# EAGLE design SparkyJr_v432u4 (EAGLE 5.10)
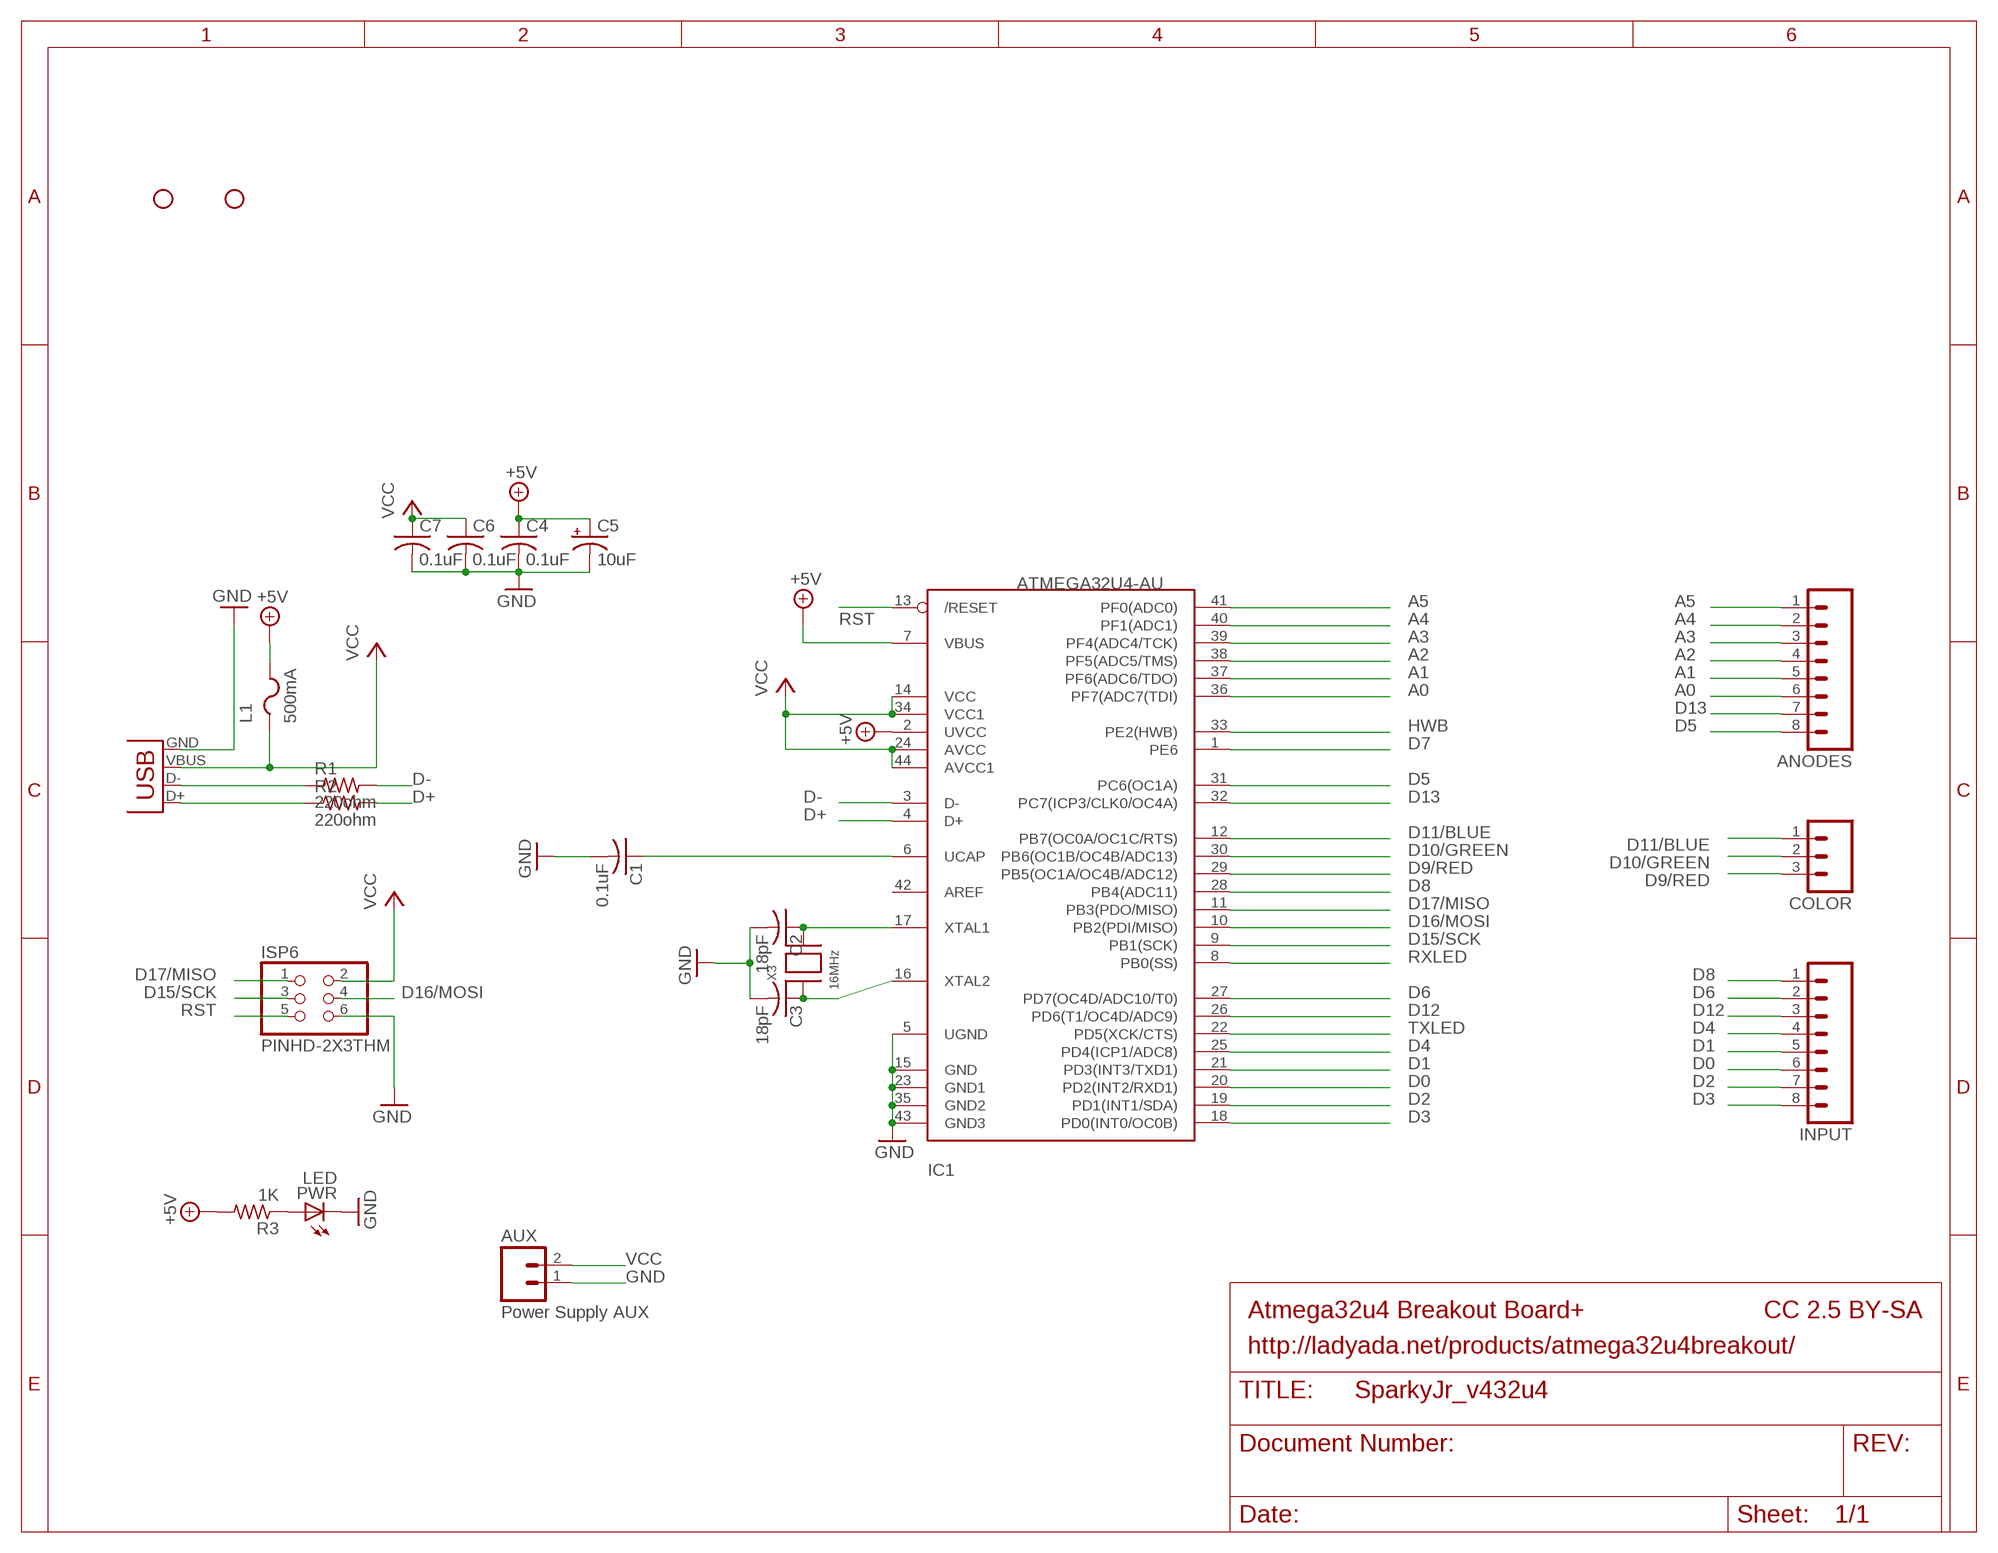
[diagram p0: schematic, sheet 1]

## Parts
ANODES  M081X08  [1X08]
AUX  Power Supply AUX  M02PTH  [1X02]
C1  0.1uF  C-USC0805K  [C0805K]
C2  18pF  C-USC0805K  [C0805K]
C3  18pF  C-USC0805K  [C0805K]
C4  0.1uF  C-USC0805K  [C0805K]
C5  10uF  CPOL-USA/3216-18R  [A/3216-18R]
C6  0.1uF  C-USC0805K  [C0805K]
C7  0.1uF  C-USC0805K  [C0805K]
CN1  MiniB USB  USBPTH  [USB-B-PTH]
COLOR  M03PTH  [1X03]
IC1  ATMEGA32U4-AU  [TQFP44]
INPUT  M081X08  [1X08]
ISP6  PINHD-2X3THM  [ISP6]
JP1  STAND-OFF  [STAND-OFF]
JP4  STAND-OFF  [STAND-OFF]
L1  500mA  PTCFUSE-1206  [R1206]
PWR  LED  LEDCHIPLED_0805  [CHIPLED_0805]
R1  220ohm  R-US_R0805  [R0805]
R2  220ohm  R-US_R0805  [R0805]
R3  1K  R-US_R0805  [R0805]
X3  16MHz  XTALNX5032  [NX5032]

## Nets
+5V: C4.1 C5.+ IC1.2(UVCC) IC1.7(VBUS) L1.2 R3.2
A0: ANODES.6 IC1.36(PF7(ADC7(TDI))
A1: ANODES.5 IC1.37(PF6(ADC6/TDO))
A2: ANODES.4 IC1.38(PF5(ADC5/TMS))
A3: ANODES.3 IC1.39(PF4(ADC4/TCK))
A4: ANODES.2 IC1.40(PF1(ADC1))
A5: ANODES.1 IC1.41(PF0(ADC0))
D0: IC1.20(PD2(INT2/RXD1)) INPUT.6
D1: IC1.21(PD3(INT3/TXD1)) INPUT.5
D2: IC1.19(PD1(INT1/SDA)) INPUT.7
D3: IC1.18(PD0(INT0/OC0B)) INPUT.8
D4: IC1.25(PD4(ICP1/ADC8)) INPUT.4
D5: ANODES.8 IC1.31(PC6(OC1A))
D6: IC1.27(PD7(OC4D/ADC10/T0)) INPUT.2
D7: IC1.1(PE6)
D8: IC1.28(PB4(ADC11)) INPUT.1
D9/RED: COLOR.3 IC1.29(PB5(OC1A/OC4B/ADC12))
D10/GREEN: COLOR.2 IC1.30(PB6(OC1B/OC4B/ADC13))
D11/BLUE: COLOR.1 IC1.12(PB7(OC0A/OC1C/RTS))
D12: IC1.26(PD6(T1/OC4D/ADC9)) INPUT.3
D13: ANODES.7 IC1.32(PC7(ICP3/CLK0/OC4A))
D15/SCK: IC1.9(PB1(SCK)) ISP6.3
D16/MOSI: IC1.10(PB2(PDI/MISO)) ISP6.4
D17/MISO: IC1.11(PB3(PDO/MISO)) ISP6.1
D+: IC1.4(D+) R2.2
D-: IC1.3(D-) R1.2
GND: AUX.1 C1.2 C2.2 C3.2 C4.2 C5.- C6.2 C7.2 CN1.GND IC1.5(UGND) IC1.15(GND) IC1.23(GND1) IC1.35(GND2) IC1.43(GND3) ISP6.6 PWR.C
HWB: IC1.33(PE2(HWB))
N$1: PWR.A R3.1
N$2: CN1.D+ R2.1
N$3: C1.1 IC1.6(UCAP)
N$5: CN1.D- R1.1
N$8: C2.1 IC1.17(XTAL1) X3.P$2
N$9: C3.1 IC1.16(XTAL2) X3.P$1
RST: IC1.13(/RESET) ISP6.5
RXLED: IC1.8(PB0(SS))
TXLED: IC1.22(PD5(XCK/CTS))
VCC: AUX.2 C6.1 C7.1 CN1.VBUS IC1.14(VCC) IC1.24(AVCC) IC1.34(VCC1) IC1.44(AVCC1) ISP6.2 L1.1
Unconnected: IC1.42(AREF)

## Notes on the sheet
- Atmega32u4 Breakout Board+ | CC 2.5 BY-SA
- http://ladyada.net/products/atmega32u4breakout/

## Library data of the parts
ANODES INPUT = SparkFun:M08: Header 8 Standard 8-pin 0.1" header. Use with straight break away headers (SKU : PRT-00116), right angle break away headers (PRT-00553), swiss pins (PRT-00743), machine pins (PRT-00117), and female headers (PRT-00115).
AUX = SparkFun:M02: Header 2 Standard 2-pin 0.1" header. Use with straight break away headers (SKU : PRT-00116), right angle break away headers (PRT-00553), swiss pins (PRT-00743), machine pins (PRT-00117), and female headers (PRT-00115). Molex polarized connector foot print use with SKU : PRT-08233 with associated crimp pins and housings.
C1-C4 C6 C7 = adafruit:C-US: CAPACITOR, American symbol
C5 = adafruit:CPOL-US: POLARIZED CAPACITOR, American symbol
CN1 = SparkFun:USB: USB Connectors USB-B-PTH is fully proven SKU : PRT-00139 USB-miniB is fully proven SKU : PRT-00587 USB-A-PCB is untested. USB-A-H is throughly reviewed, but untested. Spark Fun Electronics SKU : PRT-00437 USB-B-SMT is throughly reviewed, but untested. Needs silkscreen touching up. USB-A-S has not been used/tested USB-MB-H has not been used/tested
COLOR = SparkFun:M03: Header 3 Standard 3-pin 0.1" header. Use with straight break away headers (SKU : PRT-00116), right angle break away headers (PRT-00553), swiss pins (PRT-00743), machine pins (PRT-00117), and female headers (PRT-00115). Molex polarized connector foot print use with SKU : PRT-08232 with associated crimp pins and housings.
IC1 = adaprog:ATMEGA32U4
ISP6 = adaprog:PINHD-2X3
JP1 JP4 = SparkFun:STAND-OFF: Stand Off This is the mechanical footprint for a #4 phillips button head screw. Use the keepout ring to avoid running the screw head into surrounding components. SKU : PRT-00447
L1 = adafruit:PTCFUSE: PTC fuses, resettable thermistors
PWR = adafruit:LED: LED OSRAM: - CHIPLED LG R971, LG N971, LY N971, LG Q971, LY Q971, LO R971, LY R971 LH N974, LH R974 LS Q976, LO Q976, LY Q976 LO Q996 - Hyper CHIPLED LW Q18S LB Q993, LB Q99A, LB R99A - SideLED LS A670, LO A670, LY A670, LG A670, LP A670 LB A673, LV A673, LT A673, LW A673 LH A674 LY A675 LS A676, LA A676, LO A676, LY A676, LW A676 LS A679, LY A679, LG A679 - Hyper Micro SIDELED® LS Y876, LA Y876, LO Y876, LY Y876 LT Y87S - SmartLED LW L88C, LW L88S LB L89C, LB L89S, LG L890 LS L89K, LO L89K, LY L89K LS L896, LA L896, LO L896, LY L896 - TOPLED LS T670, LO T670, LY T670, LG T670, LP T670 LSG T670, LSP T670, LSY T670, LOP T670, LYG T670 LG T671, LOG T671, LSG T671 LB T673, LV T673, LT T673, LW T673 LH T674 LS T676, LA T676, LO T676, LY T676, LB T676, LH T676, LSB T676, LW T676 LB T67C, LV T67C, LT T67C, LS T67K, LO T67K, LY T67K, LW E67C LS E67B, LA E67B, LO E67B, LY E67B, LB E67C, LV E67C, LT E67C LW T67C LS T679, LY T679, LG T679 LS T770, LO T770, LY T770, LG T770, LP T770 LB T773, LV T773, LT T773, LW T773 LH T774 LS E675, LA E675, LY E675, LS T675 LS T776, LA T776, LO T776, LY T776, LB T776 LHGB T686 LT T68C, LB T68C - Hyper Mini TOPLED® LB M676 - Mini TOPLED Santana® LG M470 LS M47K, LO M47K, LY M47K Source: http://www.osram.convergy.de/
R1-R3 = adafruit:R-US_: RESISTOR, American symbol
X3 = adaprog:XTAL

## Board
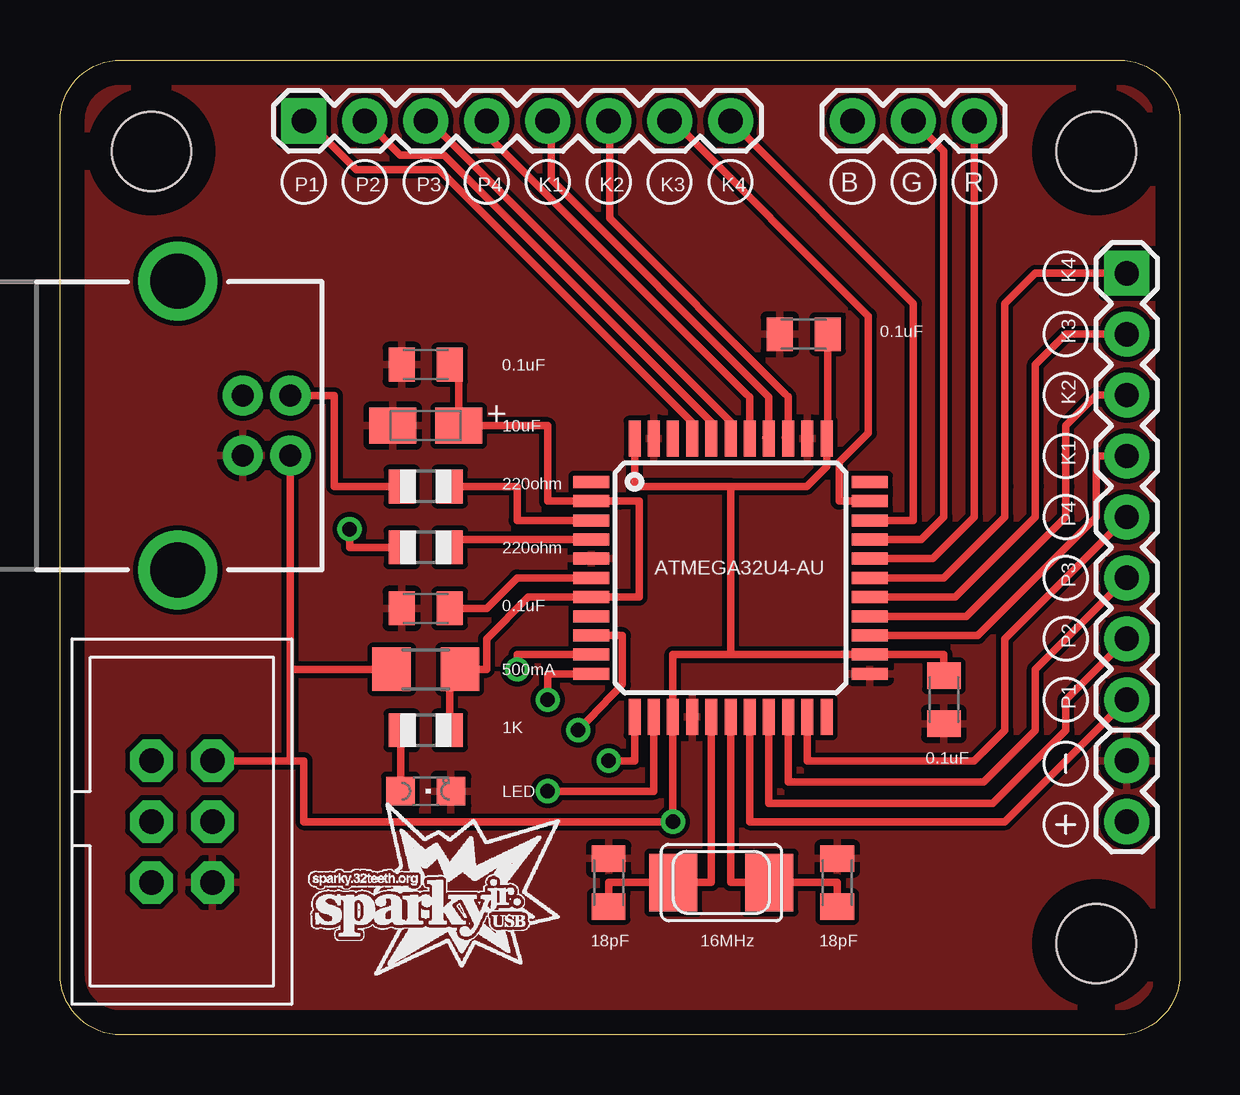
[diagram p1: board, top side]
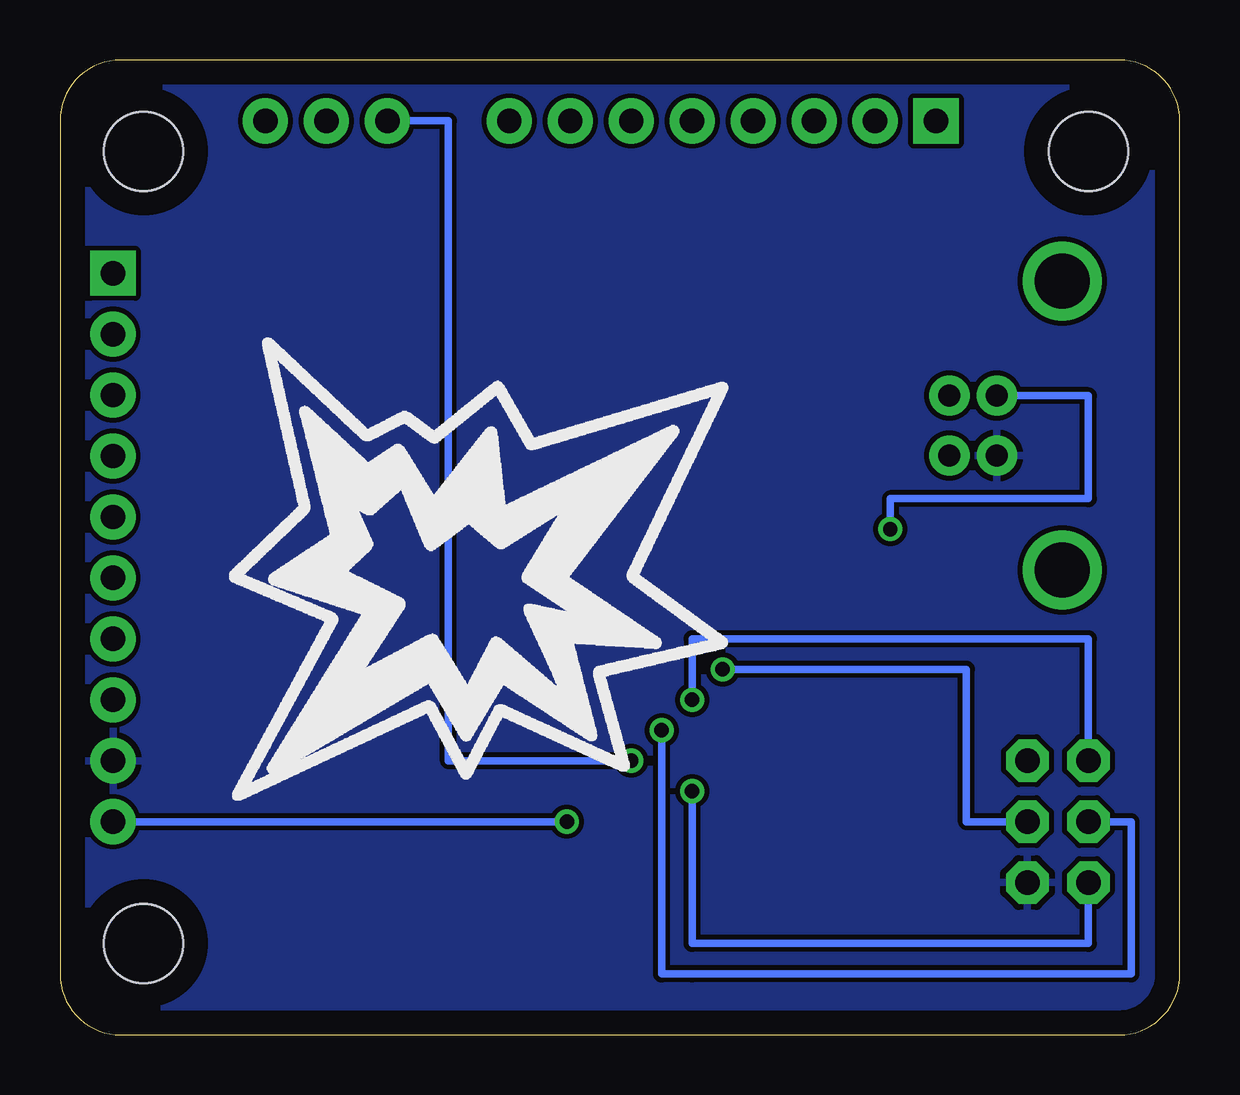
[diagram p2: board, bottom side, seen from below]

Size 46.66 x 40.64 mm. Coordinates in mm from the lower left corner, seen from the top.
Outline: 44.12,0 arc90 46.66,2.54 46.66,38.1 arc90 44.12,40.64 2.54,40.64 arc90 0,38.1 0,2.54 arc90 2.54,0
Outline: 44.12,0 2.54,0
Outline: 44.12,0 2.54,0
Copper layers (1*16): Top 0.035mm / dielectric 1.5mm / Bottom 0.035mm
Design rules "default": minimum track width 10mil, minimum drill 24mil, track to track 8mil, track to pad 8mil, pad to pad 8mil, via to via 8mil, smd to smd 8mil, copper to edge 40mil, drill to drill 8mil, minimum pad ring 10mil, minimum via ring 8mil, stop-mask expansion 4mil, vias tented up to drill 0mil, thermal gap 10mil

### Footprints (pad centres in the part's own frame; a part is rotated, then mirrored left to right if it is on the bottom)
1X08 = drill 1.016 pad 1.88 square: 1 0,0 | drill 1.016 pad 1.88 round: 2 2.54,0; 3 5.08,0; 4 7.62,0; 5 10.16,0; 6 12.7,0; 7 15.24,0; 8 17.78,0
1X02 = drill 1.016 pad 1.88 round: 1 0,0; 2 2.54,0
C0805K = smd 1.1 x 1.4: 1 -1,0; 2 1,0
A/3216-18R = smd 1.95 x 1.5: + 1.375,0; - -1.375,0
USB-B-PTH = drill 0.914 pad 1.676 round: D+ 0,1.25; D- 1.981,1.25; GND 0,-1.25; VBUS 1.981,-1.25 | drill 2.286 round: S1 -2.718,-6.02; S2 -2.718,6.02
1X03 = drill 1.016 pad 1.88 round: 1 0,0; 2 2.54,0; 3 5.08,0
TQFP44 = smd 1.5 x 0.5: 1 -5.8,4; 2 -5.8,3.2; 3 -5.8,2.4; 4 -5.8,1.6; 5 -5.8,0.8; 6 -5.8,0; 7 -5.8,-0.8; 8 -5.8,-1.6; 9 -5.8,-2.4; 10 -5.8,-3.2; 11 -5.8,-4; 23 5.8,-4; 24 5.8,-3.2; 25 5.8,-2.4; 26 5.8,-1.6; 27 5.8,-0.8; 28 5.8,0; 29 5.8,0.8; 30 5.8,1.6; 31 5.8,2.4; 32 5.8,3.2; 33 5.8,4 | smd 0.5 x 1.5: 12 -4,-5.8; 13 -3.2,-5.8; 14 -2.4,-5.8; 15 -1.6,-5.8; 16 -0.8,-5.8; 17 0,-5.8; 18 0.8,-5.8; 19 1.6,-5.8; 20 2.4,-5.8; 21 3.2,-5.8; 22 4,-5.8; 34 4,5.8; 35 3.2,5.8; 36 2.4,5.8; 37 1.6,5.8; 38 0.8,5.8; 39 0,5.8; 40 -0.8,5.8; 41 -1.6,5.8; 42 -2.4,5.8; 43 -3.2,5.8; 44 -4,5.8
ISP6 = drill 1.016 pad 1.778 octagon: 1 -2.54,-1.27; 2 -2.54,1.27; 3 0,-1.27; 4 0,1.27; 5 2.54,-1.27; 6 2.54,1.27
STAND-OFF = hole 3.302: 0,0
R1206 = smd 1.6 x 1.803: 1 -1.422,0; 2 1.422,0
CHIPLED_0805 = smd 1.2 x 1.2: A 0,-1.05; C 0,1.05
R0805 = smd 1.1 x 1.4: 1 -1,0; 2 1,0
NX5032 = smd 2 x 2.4: P$1 2,0; P$2 -2,0

### Placement (x,y rotation side)
ANODES  10.16,38.1 0 top
AUX  44.45,11.43 270 top
C1  15.24,17.78 180 top
C2  32.38,6.35 90 top
C3  22.86,6.35 90 top
C4  15.24,27.94 180 top
C5  15.24,25.4 0 top
C6  36.83,13.97 270 top
C7  30.99,29.21 180 top
CN1  7.62,25.4 0 top
COLOR  33.02,38.1 0 top
IC1  27.94,19.05 0 top
INPUT  44.45,31.75 270 top
ISP6  5.08,8.89 270 top
JP1  3.81,36.83 0 top
JP3  STAND-OFF  [STAND-OFF]  43.18,36.83 0 top
JP4  43.18,3.81 0 top
L1  15.24,15.24 0 top
PWR  15.24,10.16 270 top
R1  15.24,22.86 0 top
R2  15.24,20.32 0 top
R3  15.24,12.7 0 top
X3  27.56,6.35 180 top

### Tracks (layer width: path | path; a pad name or v marks a point on that pad's centre or on a via)
+5V
  Top 0.305: 23.32,22.25 24.13,22.25 24.13,19.05 24.13,18.25 IC1.7 20.32,18.25 19.52,18.25 17.78,16.51 17.78,15.24 L1.2 16.24,15.24 R3.2 | 23.32,22.25 IC1.2 20.32,22.25 20.32,25.4 16.82,25.4 16.82,25.25 C5.+ 16.62,27.94 C4.1 | 23.32,22.25
A0
  Top 0.305: 30.23,24.89 IC1.36 30.34,26.61 30.23,26.72 22.91,34.04 22.91,38.1 ANODES.6
A1
  Top 0.305: 29.41,24.89 IC1.37 29.54,26.59 29.41,26.72 20.47,35.66 20.47,38.1 ANODES.5
A2
  Top 0.305: ANODES.4 17.83,38.1 17.83,37.49 28.6,26.72 28.74,26.58 IC1.38
A3
  Top 0.305: ANODES.3 15.39,38.1 27.79,25.7 27.94,25.55 IC1.39
A4
  Top 0.305: ANODES.2 12.75,38.1 14.17,36.68 16,36.68 26.98,25.7 27.14,25.54 IC1.40
A5
  Top 0.305: ANODES.1 10.31,38.1 12.34,36.07 15.8,36.07 26.16,25.7 26.34,25.53 IC1.41
D0
  Top 0.305: IC1.20 30.34,10.54 38.48,10.54 40.64,12.7 40.64,15.24 INPUT.6
D1
  Top 0.305: IC1.21 31.14,11.43 38.1,11.43 39.37,12.7 39.37,16.51 INPUT.5
D2
  Top 0.305: IC1.19 29.54,9.65 38.86,9.65 41.91,12.7 41.91,13.97 INPUT.7
D3
  Top 0.305: IC1.18 28.74,8.89 39.37,8.89 43.18,12.7 INPUT.8
D4
  Top 0.305: IC1.25 36.97,16.65 38.24,16.65 43.18,21.59 43.18,22.86 43.18,24.13 INPUT.4
D5
  Top 0.305: ANODES.8 35.56,30.48 35.56,21.59 35.56,21.45 IC1.31
D6
  Top 0.305: IC1.27 36.03,18.25 37.3,18.25 40.64,21.59 40.64,22.86 40.64,27.94 41.91,29.21 INPUT.2
D8
  Top 0.305: IC1.28 35.56,19.05 36.83,19.05 39.37,21.59 39.37,22.86 39.37,30.48 40.64,31.75 INPUT.1
D9/RED
  Top 0.305: COLOR.3 38.1,21.59 36.36,19.85 IC1.29
D10/GREEN
  Top 0.305: COLOR.2 36.83,36.83 36.83,21.59 35.89,20.65 IC1.30
D11/BLUE  (via drill 0.6)
  Top 0.305: IC1.12 23.94,13.78 23.94,11.43 v22.86,11.43
  Bottom 0.305: COLOR.1 30.48,38.1 30.48,11.43 v22.86,11.43
D12
  Top 0.305: IC1.26 36.5,17.45 37.77,17.45 41.91,21.59 41.91,22.86 41.91,25.4 43.18,26.67 INPUT.3
D13
  Top 0.305: IC1.32 33.68,22.25 33.07,22.25 32.46,22.25 32.46,22.86 32.46,23.88 33.68,25.09 33.68,29.97 25.55,38.1 ANODES.7
D15/SCK  (via drill 0.6)
  Top 0.305: v21.59,12.7 23.43,14.6 23.43,16.65 IC1.9
  Bottom 0.305: ISP6.3 2.03,8.89 2.03,2.54 20.32,2.54 21.59,2.54 v21.59,12.7
D16/MOSI  (via drill 0.6)
  Top 0.305: v19.05,15.24 19.05,15.85 IC1.10
  Bottom 0.305: ISP6.4 8.89,8.89 8.89,15.24 v19.05,15.24
D17/MISO  (via drill 0.6)
  Top 0.305: v20.32,13.97 20.32,15.05 IC1.11
  Bottom 0.305: ISP6.1 3.81,16.51 20.32,16.51 v20.32,13.97
D+
  Top 0.305: R2.2 16.51,20.32 16.51,20.65 IC1.4
D-
  Top 0.305: R1.2 19.05,22.86 19.05,21.45 IC1.3
GND
  pour Top: 0,40.64 46.48,40.64 46.48,0 0,0
  pour Bottom: 0,40.64 46.99,40.64 46.99,0 0,0
N$1
  Top 0.305: R3.1 14.19,12.7 PWR.A
N$2  (via drill 0.6)
  Top 0.305: v12.07,21.08 12.07,20.32 R2.1
  Bottom 0.305: CN1.D+ 3.81,26.65 3.81,22.35 12.07,22.35 v12.07,21.08
N$3
  Top 0.305: C1.1 17.78,17.78 19.05,19.05 IC1.6
N$5
  Top 0.305: CN1.D- 11.43,26.65 11.43,22.86 R1.1
N$8
  Top 0.305: IC1.17 27.94,6.35 X3.P$2 32.38,6.35 C2.1
N$9
  Top 0.305: C3.1 22.86,6.35 X3.P$1 27.14,6.35 IC1.16
RST  (via drill 0.6)
  Top 0.305: 24.74,12.5 24.74,13.11 IC1.13 24.74,10.16 v20.32,10.16
  Bottom 0.305: ISP6.5 3.81,3.81 20.32,3.81 v20.32,10.16
VCC  (via drill 0.6)
  Top 0.305: C6.1 36.83,15.85 IC1.24 27.94,15.85 | 27.94,22.86 31.11,22.86 31.94,23.68 IC1.34 31.99,24.85 C7.1 | 27.94,22.86 23.94,22.86 IC1.44 | 27.94,15.85 25.54,15.85 IC1.14 v25.54,8.89 10.16,8.89 10.16,11.43 9.6,11.43 | 27.94,15.85 27.94,22.86 | ISP6.2 9.6,11.43 | 9.6,15.24 CN1.VBUS | 9.6,15.24 L1.1 | 9.6,11.43 9.6,15.24
  Bottom 0.305: v25.54,8.89 AUX.2

### Text on the board
tPlace: B | G | R | P1 | P2 | P3 | P4 | K1 | K2 | K3 | K4 | K4 | K3 | K2 | K1 | P4 | P3 | P2 | P1